# Altium schematic sheet etapa1_anger_X.SchDoc
size A4
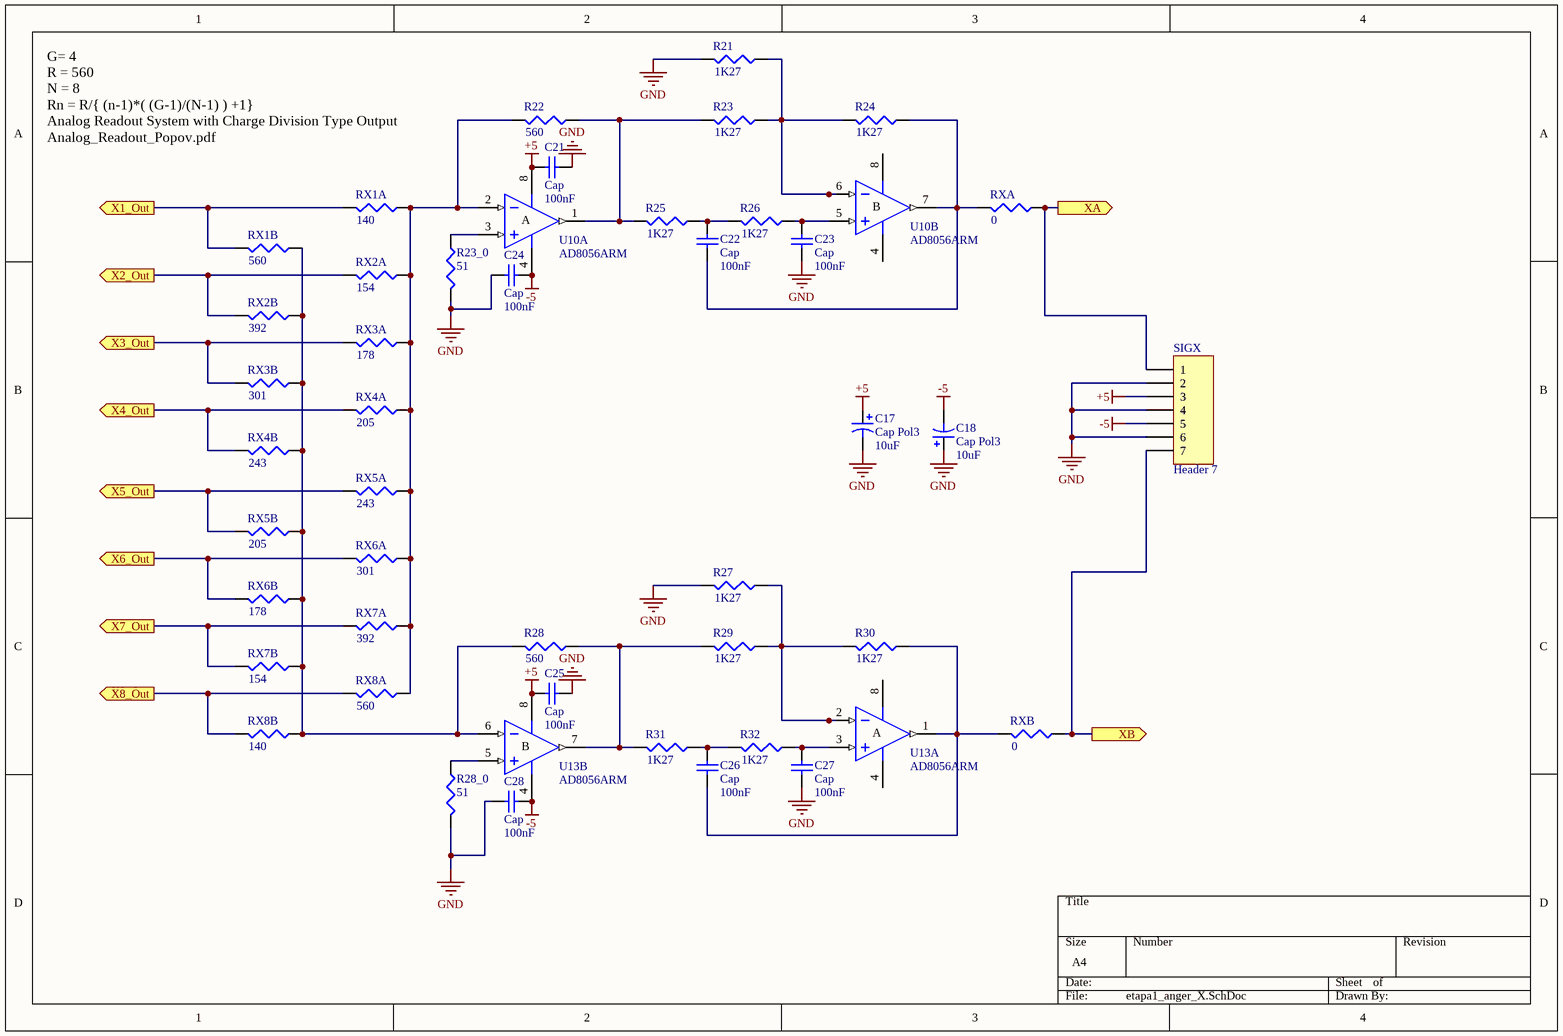
[diagram p0: etapa1_anger_X.SchDoc]

## Parts
C17  Cap Pol3  value 10uF  [C0805]
C18  Cap Pol3  value 10uF  [C0805]
C21  Cap  value 100nF  [1608[0603]]
C22  Cap  value 100nF  [1608[0603]]
C23  Cap  value 100nF  [1608[0603]]
C24  Cap  value 100nF  [1608[0603]]
C25  Cap  value 100nF  [1608[0603]]
C26  Cap  value 100nF  [1608[0603]]
C27  Cap  value 100nF  [1608[0603]]
C28  Cap  value 100nF  [1608[0603]]
R21  value 1K27  [1608[0603]]  (hidden comment: Res3)
R22  value 560  [0402]  (hidden comment: Res3)
R23  value 1K27  [0402]  (hidden comment: Res3)
R23_0  value 51  [0402]  (hidden comment: Res3)
R24  value 1K27  [0402]  (hidden comment: Res3)
R25  value 1K27  [0402]  (hidden comment: Res3)
R26  value 1K27  [0402]  (hidden comment: Res3)
R27  value 1K27  [1608[0603]]  (hidden comment: Res3)
R28  value 560  [0402]  (hidden comment: Res3)
R28_0  value 51  [0402]  (hidden comment: Res3)
R29  value 1K27  [0402]  (hidden comment: Res3)
R30  value 1K27  [0402]  (hidden comment: Res3)
R31  value 1K27  [0402]  (hidden comment: Res3)
R32  value 1K27  [0402]  (hidden comment: Res3)
RX1A  value 140  [0402]  (hidden comment: Res3)
RX1B  value 560  [0402]  (hidden comment: Res3)
RX2A  value 154  [0402]  (hidden comment: Res3)
RX2B  value 392  [0402]  (hidden comment: Res3)
RX3A  value 178  [0402]  (hidden comment: Res3)
RX3B  value 301  [0402]  (hidden comment: Res3)
RX4A  value 205  [0402]  (hidden comment: Res3)
RX4B  value 243  [0402]  (hidden comment: Res3)
RX5A  value 243  [0402]  (hidden comment: Res3)
RX5B  value 205  [0402]  (hidden comment: Res3)
RX6A  value 301  [0402]  (hidden comment: Res3)
RX6B  value 178  [0402]  (hidden comment: Res3)
RX7A  value 392  [0402]  (hidden comment: Res3)
RX7B  value 154  [0402]  (hidden comment: Res3)
RX8A  value 560  [0402]  (hidden comment: Res3)
RX8B  value 140  [0402]  (hidden comment: Res3)
RXA  value 0  [0402]  (hidden comment: Res3)
RXB  value 0  [0402]  (hidden comment: Res3)
SIGX  Header 7  [HDR1X7]
U10  AD8056ARM  [RM-8]  (parts A,B of 2)
U13  AD8056ARM  [RM-8]  (parts A,B of 2)

## Ports
X1_Out (out), X2_Out (out), X3_Out (out), X4_Out (out), X5_Out (out), X6_Out (out), X7_Out (out), X8_Out (out), XA (out), XB (out)

## Nets
+5: C17.1 C21.1 C25.1 SIGX.3 U10.8(V+) U13.8(V+)
-5: C18.2 C24.2 C28.2 SIGX.5 U10.4(V-) U13.4(V-)
GND: C17.2 C18.1 C21.2 C23.2 C24.1 C25.2 C27.2 C28.1 R21.2 R23_0.2 R27.2 R28_0.2 SIGX.2 SIGX.4 SIGX.6
X1_Out: RX1A.2 RX1B.2 ; port X1_Out
X2_Out: RX2A.2 RX2B.2 ; port X2_Out
X3_Out: RX3A.2 RX3B.2 ; port X3_Out
X4_Out: RX4A.2 RX4B.2 ; port X4_Out
X5_Out: RX5A.2 RX5B.2 ; port X5_Out
X6_Out: RX6A.2 RX6B.2 ; port X6_Out
X7_Out: RX7A.2 RX7B.2 ; port X7_Out
X8_Out: RX8A.2 RX8B.2 ; port X8_Out
XA: RXA.1 SIGX.1 ; port XA
XB: RXB.1 SIGX.7 ; port XB
NetC22_1: C22.1 R25.1 R26.2
NetC22_2: C22.2 R24.1 RXA.2 U10.7(OUT)
NetC23_1: C23.1 R26.1 U10.5(IN+)
NetC26_1: C26.1 R31.1 R32.2
NetC26_2: C26.2 R30.1 RXB.2 U13.1(OUT)
NetC27_1: C27.1 R32.1 U13.3(IN+)
NetR21_1: R21.1 R23.1 R24.2 U10.6(IN-)
NetR22_1: R22.1 R23.2 R25.2 U10.1(OUT)
NetR22_2: R22.2 RX1A.1 RX2A.1 RX3A.1 RX4A.1 RX5A.1 RX6A.1 RX7A.1 RX8A.1 U10.2(IN-)
NetR23_0_1: R23_0.1 U10.3(IN+)
NetR27_1: R27.1 R29.1 R30.2 U13.2(IN-)
NetR28_0_1: R28_0.1 U13.5(IN+)
NetR28_1: R28.1 R29.2 R31.2 U13.7(OUT)
NetR28_2: R28.2 RX1B.1 RX2B.1 RX3B.1 RX4B.1 RX5B.1 RX6B.1 RX7B.1 RX8B.1 U13.6(IN-)

## Notes on the sheet
- (near RX1A) G= 4
  R = 560
  N = 8
  Rn = R/{ (n-1)*( (G-1)/(N-1) ) +1}
  Analog Readout System with Charge Division Type Output
  Analog_Readout_Popov.pdf
- (in symbol AD8056ARM, part A) A
- (in symbol AD8056ARM, part B) B

## Library data of the parts
C17 C18 = Cap Pol3: Polarized Capacitor (Surface Mount); Published: 8-Jun-2000; LatestRevisionDate: 29-May-2009; LatestRevisionNote: IPC-7351 Footprint Added.; PackageReference: C0805; Publisher: Altium Limited; PackageDescription: Chip Capacitor
C21-C28 = Cap: Capacitor; Published: 8-Jun-2000; LatestRevisionDate: 17-Jul-2002; LatestRevisionNote: Re-released for DXP Platform.; PackageReference: RAD-0.3; Publisher: Altium Limited; PackageDescription: Radial Cap, Thru-Hole; 2 Leads; 0.3 in Pin Spacing
R21-R23 R23_0 R24-R28 R28_0 R29-R32 RX1A RX1B RX2A RX2B RX3A RX3B RX4A RX4B RX5A RX5B RX6A RX6B RX7A RX7B RX8A RX8B RXA RXB = Res3: Resistor; Published: 8-Jun-2000; LatestRevisionDate: 29-May-2009; LatestRevisionNote: IPC-7351 Footprint Added.; PackageReference: J1-0603; Publisher: Altium Limited; PackageDescription: Chip Resistor
SIGX = Header 7: Header, 7-Pin; LatestRevisionDate: 17-Jul-2002; LatestRevisionNote: Re-released for DXP Platform.; Publisher: Altium Limited
U10 U13 = AD8056ARM: Low Cost, 300MHz Voltage Feedback Amplifier; Published: 8-Jun-2000; LatestRevisionDate: 04-Mar-2005; LatestRevisionNote: Stylized 3D Model Added, PCB footprint pad width decreased.; DatasheetVersion: REV. 0 1997; PackageVersion: 2004; PackageReference: RM-8; Publisher: Altium Limited; PackageDescription: Shrink Small Outline, MSOP; 8 Leads; Body Width 3 mm; Pitch 0.65 mm; Code_JEDEC: MO-187-AA; ComponentLink1Description: Manufacturer Link; ComponentLink1URL: http://www.analog.com/en/prod/0,,759_786_AD8055%2C00.html; ComponentLink2Description: Datasheet; ComponentLink2URL: http://www.analog.com/UploadedFiles/Data_Sheets/40402558757264AD8055_6_i.pdf